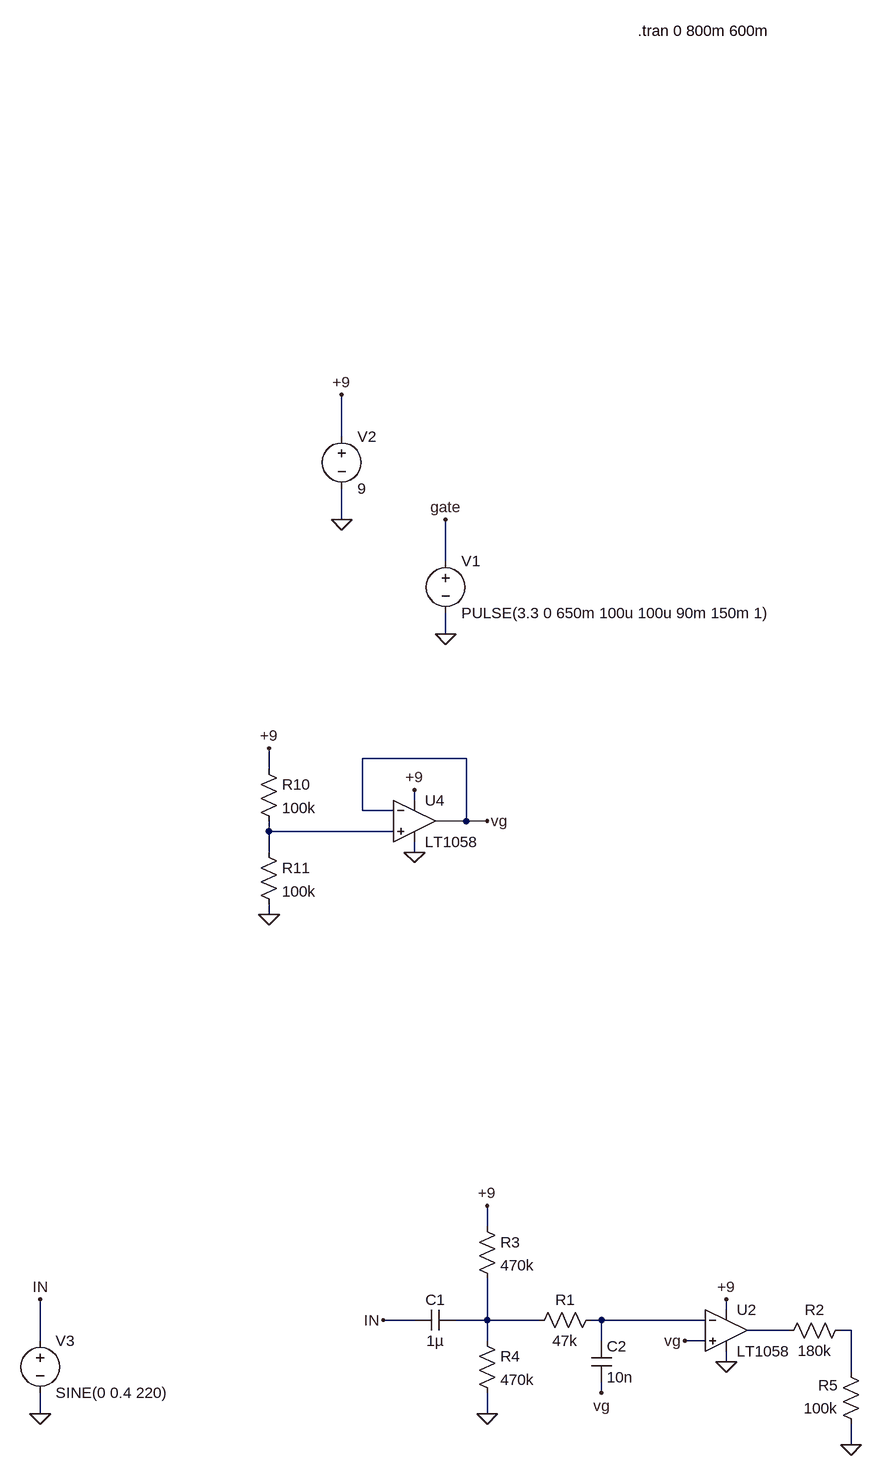
[diagram p0: schematic TunerDriverSim.asc]
TunerDriverSim.asc, the LTspice schematic file:
Version 4
SHEET 1 3420 3584
WIRE -496 736 -496 672
WIRE -496 864 -496 816
WIRE -336 928 -336 864
WIRE -336 1040 -336 1008
WIRE -304 1232 -464 1232
WIRE -608 1248 -608 1216
WIRE -384 1296 -384 1280
WIRE -464 1312 -464 1232
WIRE -416 1312 -464 1312
WIRE -304 1328 -304 1232
WIRE -304 1328 -352 1328
WIRE -272 1328 -304 1328
WIRE -608 1344 -608 1328
WIRE -416 1344 -608 1344
WIRE -608 1376 -608 1344
WIRE -384 1376 -384 1360
WIRE -608 1472 -608 1456
WIRE -272 1952 -272 1920
WIRE 96 2080 96 2064
WIRE -384 2096 -432 2096
WIRE -272 2096 -272 2032
WIRE -272 2096 -320 2096
WIRE -192 2096 -272 2096
WIRE -96 2096 -112 2096
WIRE 64 2096 -96 2096
WIRE 192 2112 128 2112
WIRE 288 2112 272 2112
WIRE -960 2128 -960 2064
WIRE -272 2128 -272 2096
WIRE -96 2128 -96 2096
WIRE 64 2128 32 2128
WIRE 96 2160 96 2144
WIRE 288 2176 288 2112
WIRE -96 2208 -96 2192
WIRE -960 2240 -960 2208
WIRE -272 2240 -272 2208
WIRE 288 2288 288 2256
FLAG -496 672 +9
FLAG -496 864 0
FLAG -384 1280 +9
FLAG -384 1376 0
FLAG -272 1328 vg
FLAG -608 1472 0
FLAG -608 1216 +9
FLAG -336 1040 0
FLAG -336 864 gate
FLAG -960 2064 IN
FLAG -432 2096 IN
FLAG -960 2240 0
FLAG 96 2064 +9
FLAG 96 2160 0
FLAG 32 2128 vg
FLAG 288 2288 0
FLAG -96 2208 vg
FLAG -272 1920 +9
FLAG -272 2240 0
SYMBOL voltage -496 720 R0
SYMATTR InstName V2
SYMATTR Value 9
SYMBOL OpAmps/LT1058 -384 1264 R0
SYMATTR InstName U4
SYMBOL res -624 1232 R0
SYMATTR InstName R10
SYMATTR Value 100k
SYMBOL res -624 1360 R0
SYMATTR InstName R11
SYMATTR Value 100k
SYMBOL voltage -336 912 R0
SYMATTR InstName V1
SYMATTR Value PULSE(3.3 0 650m 100u 100u 90m 150m 1)
SYMBOL voltage -960 2112 R0
SYMATTR InstName V3
SYMATTR Value SINE(0 0.4 220)
SYMBOL res -96 2080 R90
WINDOW 0 0 56 VBottom 2
WINDOW 3 32 56 VTop 2
SYMATTR InstName R1
SYMATTR Value 47k
SYMBOL cap -112 2128 R0
SYMATTR InstName C2
SYMATTR Value 10n
SYMBOL OpAmps/LT1058 96 2048 R0
SYMATTR InstName U2
SYMBOL res 288 2096 R90
WINDOW 0 0 56 VBottom 2
WINDOW 3 32 56 VTop 2
SYMATTR InstName R2
SYMATTR Value 180k
SYMBOL res 304 2272 R180
WINDOW 0 36 76 Left 2
WINDOW 3 36 40 Left 2
SYMATTR InstName R5
SYMATTR Value 100k
SYMBOL res -288 1936 R0
SYMATTR InstName R3
SYMATTR Value 470k
SYMBOL res -288 2112 R0
SYMATTR InstName R4
SYMATTR Value 470k
SYMBOL cap -320 2080 R90
WINDOW 0 0 32 VBottom 2
WINDOW 3 32 32 VTop 2
SYMATTR InstName C1
SYMATTR Value 1µ
TEXT -40 112 Left 2 !.tran 0 800m 600m

The netlist it stands for:
* TunerDriverSim.asc
V2 +9 0 9
XU4 N001 vg +9 0 vg LT1057  ; LT1058, pins In+ In- V+ V- OUT
R10 +9 N001 100k
R11 N001 0 100k
V1 gate 0 PULSE(3.3 0 650m 100u 100u 90m 150m 1)
V3 IN 0 SINE(0 0.4 220)
R1 N003 N002 47k
C2 N003 vg 10n
XU2 vg N003 +9 0 N004 LT1057  ; LT1058, pins In+ In- V+ V- OUT
R2 N005 N004 180k
R5 0 N005 100k
R3 +9 N002 470k
R4 N002 0 470k
C1 N002 IN 1µ
.tran 0 800m 600m
.lib LTC.lib
.backanno
.end